# Altium schematic sheet Player.SchDoc
size A2; SheetNumber: 1; SheetTotal: 2
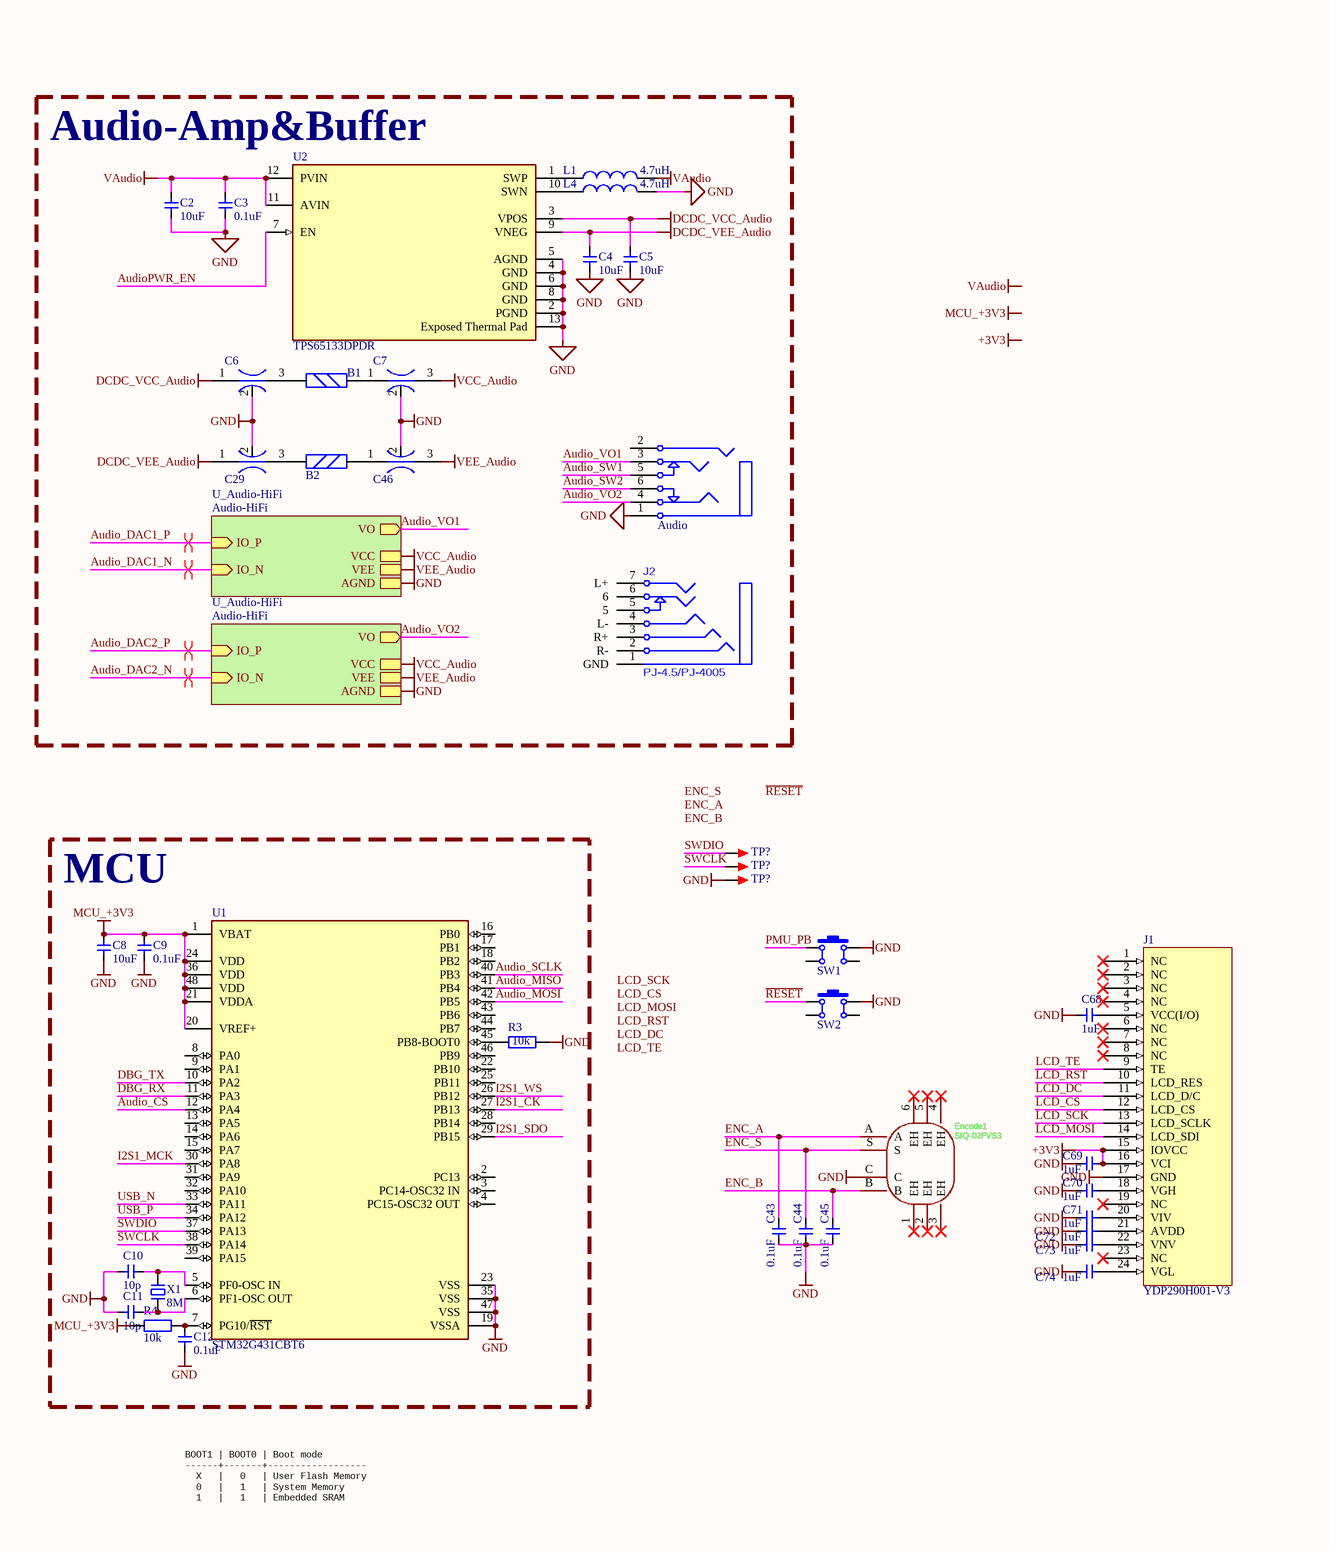
[diagram p0: Player.SchDoc, left]
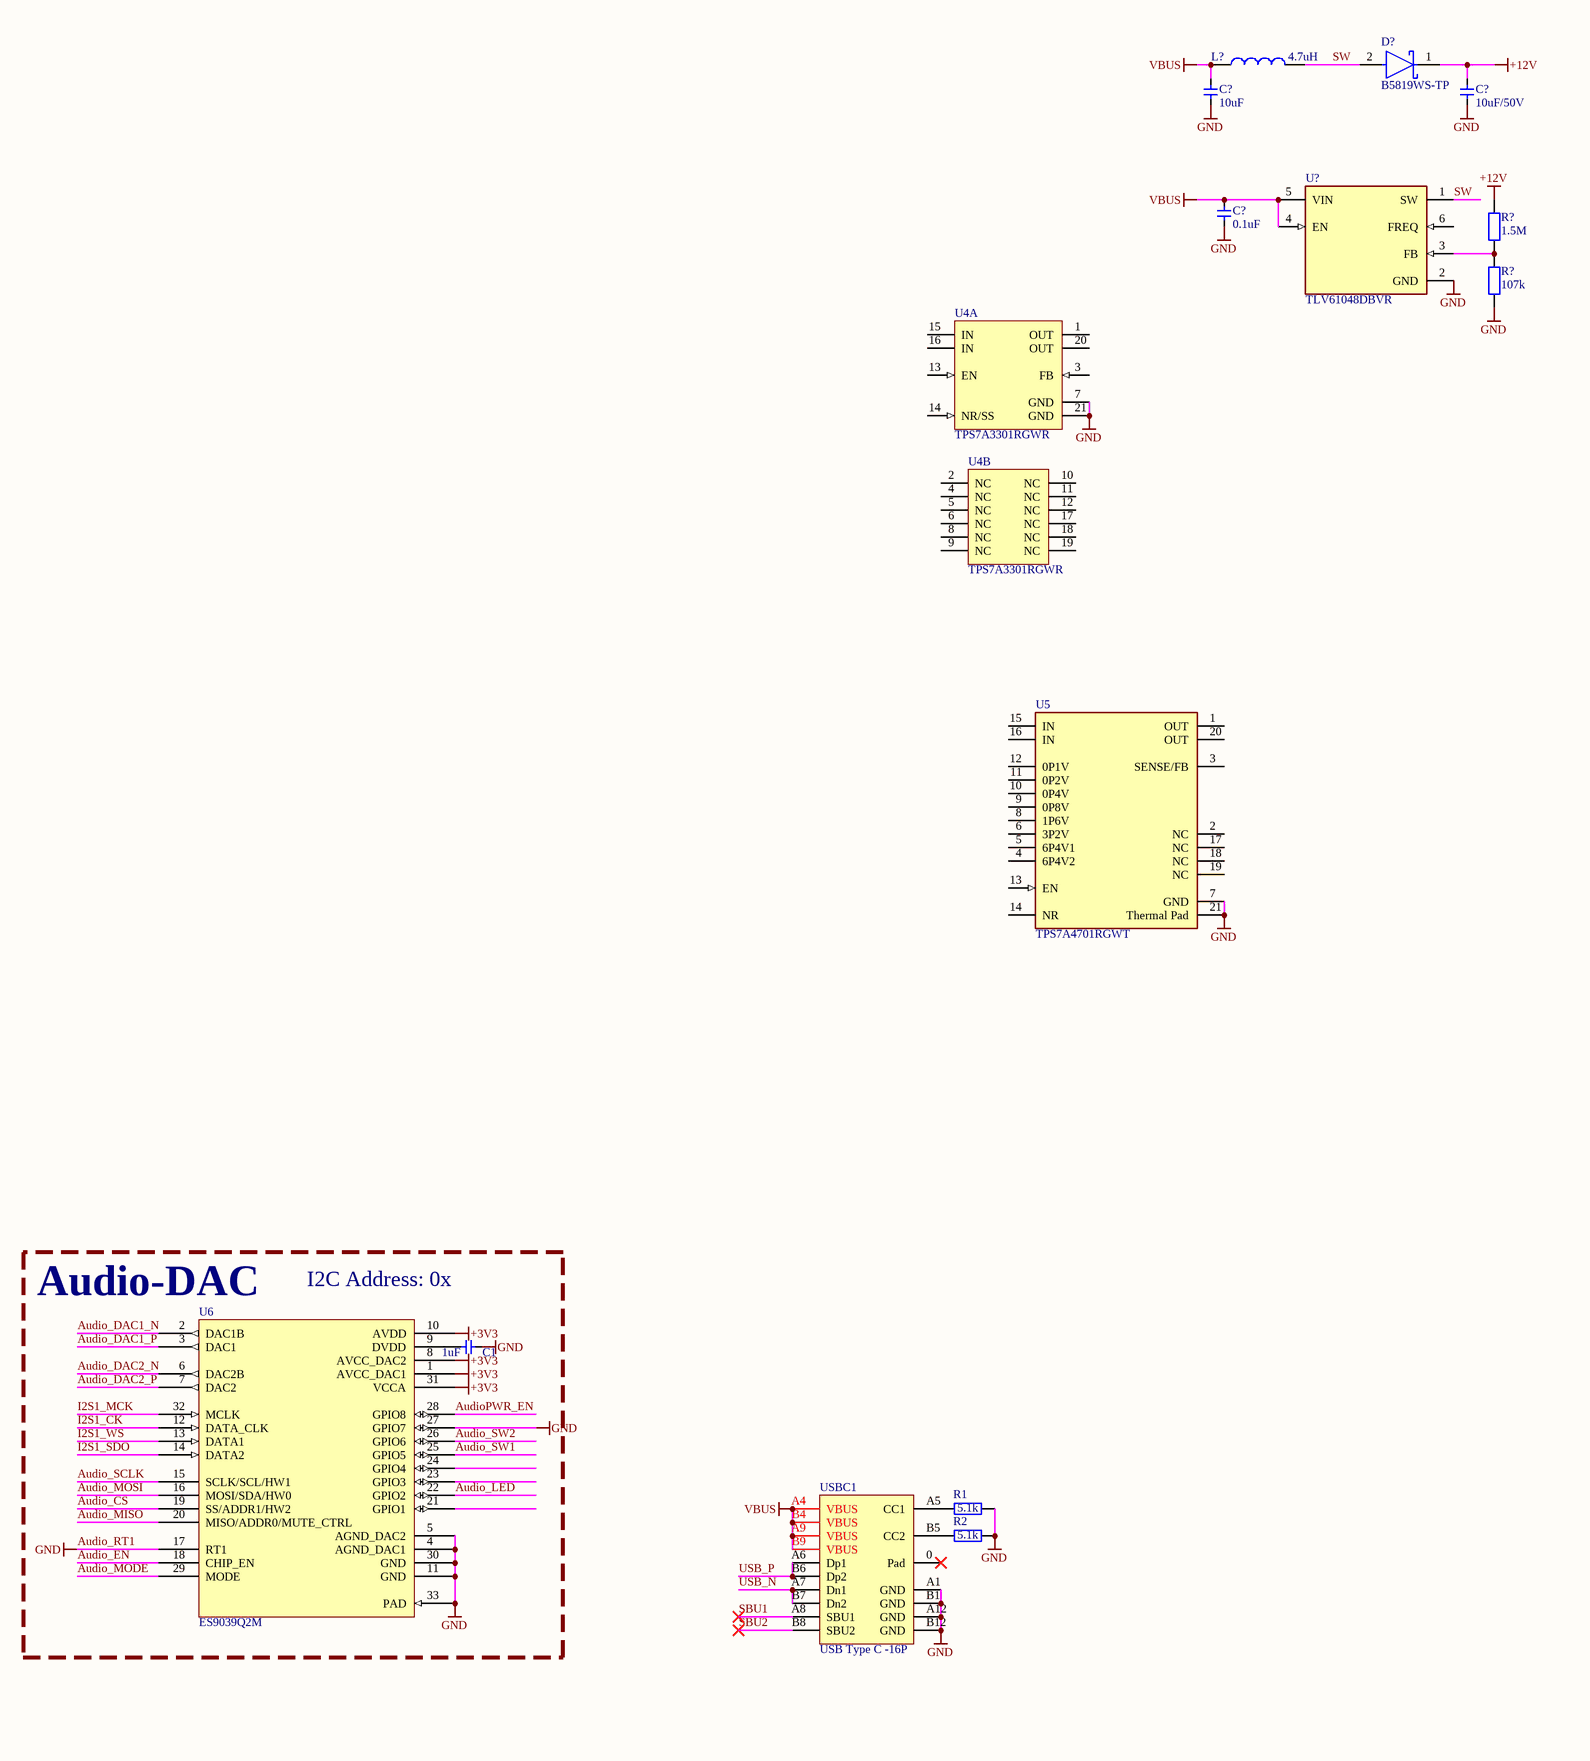
[diagram p1: Player.SchDoc, right]

## Parts
(Parts that share a designator on the sheet are numbered #1, #2 ... from top to bottom, then left to right.)
Audio  PJ342  [PJ342A]  (value not drawn)
B1  BLM15AG601SN1D  [L0603]  (value not drawn)
B2  BLM15AG601SN1D  [L0603]  (value not drawn)
C1  1uF  [0402-C]
C2  10uF  [0402-C]
C3  0.1uF  [0402-C]
C4  10uF  [0402-C]
C5  10uF  [0402-C]
C6  NFM18PS105D0J3D  [FP-NFM18-0_1-e0_05_0_35-MFG]  (value not drawn)
C7  NFM18PS105D0J3D  [FP-NFM18-0_1-e0_05_0_35-MFG]  (value not drawn)
C8  10uF  [0402-C]
C9  0.1uF  [0402-C]
C10  10p  [0402-C]
C11  10p  [0402-C]
C12  0.1uF  [0402-C]
C29  NFM18PS105D0J3D  [FP-NFM18-0_1-e0_05_0_35-MFG]  (value not drawn)
C43  0.1uF  [0402-C]
C44  0.1uF  [0402-C]
C45  0.1uF  [0402-C]
C46  NFM18PS105D0J3D  [FP-NFM18-0_1-e0_05_0_35-MFG]  (value not drawn)
C68  1uF  [0402-C]
C69  1uF  [0402-C]
C70  1uF  [0402-C]
C71  1uF  [0402-C]
C72  1uF  [0402-C]
C73  1uF  [0402-C]
C74  1uF  [0402-C]
C?#1  10uF  [0603-C]
C?#2  10uF/50V  [0603-C]
C?#3  0.1uF  [0402-C]
D?  B5819WS-TP  [FP-SOD-323-IPC_C]
Encode1  SIQ-02FVS3  [SW-SMD_SIQ-02FVS3_1]
J1  YDP290H001-V3  [FPC0.5-WT-24P]
J2  PJ-4.5/PJ-4005  [PJ-4.5]
L1  4.7uH  [L0805]
L4  4.7uH  [L0805]
L?  4.7uH  [L0805]
R1  5.1k  [0603-R]
R2  5.1k  [0603-R]
R3  10k  [0402-R]
R4  10k  [0402-R]
R?#1  1.5M  [0603-R]
R?#2  107k  [0603-R]
SW1  TD-1187SA-250  [SW-SMD-3.5*3.0_4P]  (value not drawn)
SW2  TD-1187SA-250  [SW-SMD-3.5*3.0_4P]  (value not drawn)
TP?#1  (no value)  [TEST 1]
TP?#2  (no value)  [TEST 1]
TP?#3  (no value)  [TEST 1]
U1  STM32G431CBT6  [FP-LQFP48-5B-MFG]
U2  TPS65133DPDR  [FP-DPD0012A-MFG]
U4  TPS7A3301RGWR  [RGW0020A_V]  (parts A,B of 2)
U5  TPS7A4701RGWT  [FP-RGW0020A-MFG]
U6  ES9039Q2M  [QFN32 5x5_L]
U?  TLV61048DBVR  [FP-DBV0006A-IPC_B]
USBC1  USB Type C -16P  [USB-C-SMD_16P]
X1  8M  [XTAL-3215-2P]

## Blocks framed on the sheet
Audio-Amp&Buffer: Audio B1 B2 C2-C7 C29 C46 J2 L1 L4 U2
MCU: C8-C12 R3 R4 U1 X1
Audio-DAC: C1 U6

## Sub-sheets
U_Audio-HiFi = Audio-HiFi: IO_N (in), IO_P (in), VO (out), VCC, VEE, AGND
U_Audio-HiFi = Audio-HiFi: IO_N (in), IO_P (in), VO (out), VCC, VEE, AGND

## Nets
+3V3: C69.2 J1.15(IOVCC) J1.16(VCI) U6.1(AVCC_DAC1) U6.8(AVCC_DAC2) U6.10(AVDD) U6.31(VCCA)
+12V: C?#2.2 D?.1(C) R?#1.2
Audio_RT1: Audio.1 C1.2 C2.1 C3.1 C4.1 C5.1 C6.2(GND) C7.2(GND) C8.1 C9.1 C10.1 C11.1 C12.2 C29.2(GND) C43.2 C44.2 C45.2 C46.2(GND) C68.1 C69.1 C70.1 C71.1 C72.1 C73.1 C74.1 C?#1.1 C?#2.1 C?#3.1 Encode1.C J1.17(GND) L4.2 R1.2 R2.2 R3.1 R?#2.1 SW1.2 SW2.2 TP?#3.1 U1.19(VSSA) U1.23(VSS) U1.35(VSS) U1.47(VSS) U2.2(PGND) U2.4(GND) U2.5(AGND) U2.6(GND) U2.8(GND) U2.13(Exposed_Thermal_Pad) U4.7(GND) U4.21(GND) U5.7(GND) U5.21(Thermal_Pad) U6.4(AGND_DAC1) U6.5(AGND_DAC2) U6.11(GND) U6.17(RT1) U6.27(GPIO7) U6.30(GND) U6.33(PAD) U?.2(GND) USBC1.A1(GND) USBC1.A12(GND) USBC1.B1(GND) USBC1.B12(GND) ; sheet U_Audio-HiFi/AGND, sheet U_Audio-HiFi/AGND  [also labelled GND]
DCDC_VCC_Audio: C5.2 C6.1(Input) U2.3(VPOS)
DCDC_VEE_Audio: C4.2 C29.1(Input) U2.9(VNEG)
MCU_+3V3: C8.2 C9.2 R4.1 U1.1(VBAT) U1.20(VREF+) U1.21(VDDA) U1.24(VDD) U1.36(VDD) U1.48(VDD)
VAudio: C2.2 C3.2 L1.2 U2.11(AVIN) U2.12(PVIN)
VBUS: C?#1.2 C?#3.2 L?.1 U?.4(EN) U?.5(VIN) USBC1.A4(VBUS) USBC1.A9(VBUS) USBC1.B4(VBUS) USBC1.B9(VBUS)
VCC_Audio: C7.3(Output) ; sheet U_Audio-HiFi/VCC, sheet U_Audio-HiFi/VCC
VEE_Audio: C46.3(Output) ; sheet U_Audio-HiFi/VEE, sheet U_Audio-HiFi/VEE
Audio_CS: U1.12(PA4) U6.19(SS/ADDR1/HW2)
Audio_DAC1_N: U6.2(DAC1B) ; sheet U_Audio-HiFi/IO_N
Audio_DAC1_P: U6.3(DAC1) ; sheet U_Audio-HiFi/IO_P
Audio_DAC2_N: U6.6(DAC2B) ; sheet U_Audio-HiFi/IO_N
Audio_DAC2_P: U6.7(DAC2) ; sheet U_Audio-HiFi/IO_P
Audio_EN: U6.18(CHIP_EN)
Audio_LED: U6.22(GPIO2)
Audio_MISO: U1.41(PB4) U6.20(MISO/ADDR0/MUTE_CTRL)
Audio_MODE: U6.29(MODE)
Audio_MOSI: U1.42(PB5) U6.16(MOSI/SDA/HW0)
Audio_SCLK: U1.40(PB3) U6.15(SCLK/SCL/HW1)
Audio_SW1: Audio.5 U6.25(GPIO5)
Audio_SW2: Audio.6 U6.26(GPIO6)
Audio_VO1: Audio.3 ; sheet U_Audio-HiFi/VO
Audio_VO2: Audio.4 ; sheet U_Audio-HiFi/VO
AudioPWR_EN: U2.7(EN) U6.28(GPIO8)
DBG_RX: U1.11(PA3)
DBG_TX: U1.10(PA2)
ENC_A: C43.1 Encode1.A
ENC_B: C45.1 Encode1.B
ENC_S: C44.1 Encode1.S
I2S1_CK: U1.27(PB13) U6.12(DATA_CLK)
I2S1_MCK: U1.30(PA8) U6.32(MCLK)
I2S1_SDO: U1.29(PB15) U6.14(DATA2)
I2S1_WS: U1.26(PB12) U6.13(DATA1)
LCD_CS: J1.12(LCD_CS)
LCD_DC: J1.11(LCD_D/C)
LCD_MOSI: J1.14(LCD_SDI)
LCD_RST: J1.10(LCD_RES)
LCD_SCK: J1.13(LCD_SCLK)
LCD_TE: J1.9(TE)
PMU_PB: SW1.1
~{RESET}: SW2.1
SBU1: USBC1.A8(SBU1)
SBU2: USBC1.B8(SBU2)
SW: D?.2(A) L?.2 U?.1(SW)
SWCLK: TP?#2.1 U1.38(PA14)
SWDIO: TP?#1.1 U1.37(PA13)
USB_N: U1.33(PA11) USBC1.A7(Dn1) USBC1.B7(Dn2)
USB_P: U1.34(PA12) USBC1.A6(Dp1) USBC1.B6(Dp2)
NetB1_1: B1.1 C7.1(Input)
NetB1_2: B1.2 C6.3(Output)
NetB2_1: B2.1 C46.1(Input)
NetB2_2: B2.2 C29.3(Output)
NetC1_1: C1.1 U6.9(DVDD)
NetC10_2: C10.2 U1.5(PF0-OSC_IN) X1.2
NetC11_2: C11.2 U1.6(PF1-OSC_OUT) X1.1
NetC12_1: C12.1 R4.2 U1.7(PG10/~{RST})
NetC68_2: C68.2 J1.5(VCC(I/O))
NetC70_2: C70.2 J1.18(VGH)
NetC71_2: C71.2 J1.20(VIV)
NetC72_2: C72.2 J1.21(AVDD)
NetC73_2: C73.2 J1.22(VNV)
NetC74_2: C74.2 J1.24(VGL)
NetL1_1: L1.1 U2.1(SWP)
NetL4_1: L4.1 U2.10(SWN)
NetR1_1: R1.1 USBC1.A5(CC1)
NetR2_1: R2.1 USBC1.B5(CC2)
NetR3_2: R3.2 U1.45(PB8-BOOT0)
NetR?#1_1: R?#1.1 R?#2.2 U?.3(FB)

Not connected (* = marked no-connect by the designer): Audio 2; Encode1 1(EH)* 2(EH)* 3(EH)* 4(EH)* 5(EH)* 6(EH)*; J1 1(NC)* 2(NC)* 3(NC)* 4(NC)* 6(NC)* 7(NC)* 8(NC)* 19(NC)* 23(NC)*; J2 1(GND) 2(R-) 3(R+) 4(L-) 5 6 7(L+); SW1 3 4; SW2 3 4; U1 2(PC13) 3(PC14-OSC32_IN) 4(PC15-OSC32_OUT) 8(PA0) 9(PA1) 13(PA5) 14(PA6) 15(PA7) 16(PB0) 17(PB1) 18(PB2) 22(PB10) 25(PB11) 28(PB14) 31(PA9) 32(PA10) 39(PA15) 43(PB6) 44(PB7) 46(PB9); U4 1(OUT) 2(NC) 3(FB) 4(NC) 5(NC) 6(NC) 8(NC) 9(NC) 10(NC) 11(NC) 12(NC) 13(EN) 14(NR/SS) 15(IN) 16(IN) 17(NC) 18(NC) 19(NC) 20(OUT); U5 1(OUT) 2(NC) 3(SENSE/FB) 4(6P4V2) 5(6P4V1) 6(3P2V) 8(1P6V) 9(0P8V) 10(0P4V) 11(0P2V) 12(0P1V) 13(EN) 14(NR) 15(IN) 16(IN) 17(NC) 18(NC) 19(NC) 20(OUT); U6 21(GPIO1) 23(GPIO3) 24(GPIO4); U? 6(FREQ); USBC1 0(Pad)*

## Layout directives
differential pair: Audio_DAC1_N, Audio_DAC1_P, Audio_DAC2_N, Audio_DAC2_P

## Notes on the sheet
- I2C Address: 0x
- BOOT1 | BOOT0 | Boot mode
  ------+-------+------------------
  X   |   0   | User Flash Memory
  0   |   1   | System Memory
  1   |   1   | Embedded SRAM
- Labels drawn without touching a wire or pin: +3V3, ENC_A, ENC_B, ENC_S, LCD_CS, LCD_DC, LCD_MOSI, LCD_RST, LCD_SCK, LCD_TE, MCU_+3V3, VAudio, ~{RESET}

## Library data of the parts
Audio = PJ342: 3.5耳机插座,4Pin; BOM名称: 耳机插座; 当前库版本V2023.8.14 @淘宝卖家:黄晶宝石: 最新版本发布https://item.taobao.com/item.htm?id=566775463719
B1 B2 = BEAD
C1-C5 C8-C12 C43-C45 C68-C74 C?#1-C?#3 = 电容-0402: Capacitor; Value: 0.1u
C6 C7 C29 C46 = CMP-06053-000028-1: CAP FEEDTHRU 1UF 20% 6.3V 0603; DC Resistance (DCR): 30mR; Current: 2A; Length: 0.063inch; Package Quantity: 4000; Capacitance: 1uF; Height: 0.028inch; Mount: Surface Mount; Max Operating Temperature: 125°C; Voltage Rating: 6.3V; Case/Package: 0603; Tolerance: 20%; Case Code (Metric): 1608; Min Operating Temperature: -55°C; Packaging: Tape and Reel; Case Code (Imperial): 0603; Voltage Rating (DC): 6.3V; Width: 0.031inch
D? = CMP-56206-000009-1: DIODE SCHOTTKY 40V 1A SOD323; Max Reverse Leakage Current: 1mA; Peak Non-Repetitive Surge Current: 10A; Forward Voltage: 900mV; Element Configuration: Single; Max Reverse Voltage (DC): 40V; Number of Pins: 2; Max Operating Temperature: 125°C; Package Quantity: 1; Radiation Hardening: No; Average Rectified Current: 1A; Lead Free: Lead Free; Series: -; Mount: Surface Mount; Min Operating Temperature: -65°C; RoHS Compliant: Yes; Packaging: Tape and Reel; Max Surge Current: 10A
Encode1 = SIQ-02FVS3: Manufacturer: MITSUMI(美上美); Add into BOM: yes; Symbol: SIQ-02FVS3; Device: SIQ-02FVS3; LCSC Part Name: 拨轮滚轮旋转编码器开关; Supplier Part: C2925423; Manufacturer Part: SIQ-02FVS3; Supplier Footprint: SMD; JLCPCB Part Class: Extended Part; Datasheet: https://atta.szlcsc.com/upload/public/pdf/source/20220728/2FBC1A98A06DC86460FC69DAE20456FC.pdf; Supplier: LCSC; Convert to PCB: yes
J1 = YDP290H001-V3: 鱼鹰光电
L1 L4 L? = L: 贴片小功率电感; BOM名称: 小功率贴片电感; 联系下单店铺卖家 免费帮你查找封装: 联系下单店铺卖家 免费技术支持
R1-R4 R?#1 R?#2 = R: 贴片电阻; 联系卖家，免费查找封装: 唯一出售店铺网址https://shop463601444.taobao.com; BOM名称: 贴片电阻
SW1 SW2 = TD-1187SA-250: 小乌龟-侧按4脚开关 带定位柱; 联系下单店铺卖家 免费技术支持: 联系下单店铺卖家 免费帮你查找封装
TP?#1-TP?#3 = TEST: 测试点; 联系下单店铺卖家 免费技术支持: 联系下单店铺卖家 免费帮你查找封装; BOM名称: 测试点
U1 = CMP-12105-000030-1: MAINSTREAM ARM CORTEX-M4+ MCU 17; Manufacturer: STMicroelectronics; Number Of Adc Channels: 17; Number Of I/Os: 38; Standoff Height: 0.05mm; Number Of Usb Channels: 1; Data Bus Width: 32bits; Number Of I2C Channels: 3; Number Of Pwm Channels: 31; Frequency: 170MHz; Memory Type: FLASH; Number Of Timers/Counters: 14; Ram Size: 32KBytes; Max Junction Temp: +105°C; Memory Size: 128KBytes; Min Supply Voltage: 1.62V; Max Supply Voltage: 3.6V; Number Of Uart Channels: 4; Interface: I2C,SPI,UART,USART,CAN,USB,LIN,IrDA,I2S; Temperature Range Low: -40°C; Lead Free: Yes; Device Class L3: Microcontrollers; Number Of Cores: 1; Temperature Range High: +85°C; Height: 1.6mm; Digikey Description: MAINSTREAM ARM CORTEX-M4+ MCU 17; Device Class L1: Integrated Circuits (ICs); Package: LQFP48-5B; RoHS: TRUE; Number Of A/D Converters: 1; Core Architecture: Arm Cortex-M4; Device Class L2: Embedded Processors and Controllers; ComponentLink2Description: Datasheet; Temperature: -40°C to +85°C; Ambient Temperature Range High: +85°C; Ambient Temperature Range Low: -40°C; Octopart: https://octopart.com/stm32g431cbt6-stmicroelectronics-98835224; ComponentLink2URL: https://www.st.com/resource/en/datasheet/stm32g431cb.pdf; Automotive: No; Number Of Spi Channels: 3; Manufacturer Part Number: STM32G431CBT6; Category: IC
U2 = CMP-04918-000430-1: IC REG AMOLED DISPL 2OUT 12WSON; Number of Channels: 2; Max Supply Voltage: 5V; Min Supply Voltage: 2.9V; Output Voltage: -5V; Mount: Surface Mount; Case/Package: QFN; Packaging: Tape and Reel; Lead Free: Lead Free; Radiation Hardening: No; Min Operating Temperature: -40°C; Number of Outputs: 2; Max Operating Temperature: 85°C; Number of Pins: 12; RoHS Compliant: Yes; Package Quantity: 3000
U4 = CMP-0395-01391-2: Single Output High PSRR LDO, 1 A, Adjustable -1.18 to -33 V Output, -3 to -36 V Input, with Ultra-Low Noise, 20-pin VQFN (RGW), -40 to 125 degC, Green (RoHS & no Sb/Br); Manufacturer: Texas Instruments; SubFamily: Single Channel LDO; Vdo(Typ)(mV): 290; Iq(Typ)(mA): 0.21; Iout(Max)(A): 1; Accuracy(%): 1.5; PackageDescription: 20-Pin Plastic Quad Flat No-Pin, 5 x 5 mm Body, 0.65 mm Pitch, 3.15 x 3.15 mm Exposed Pad; DatasheetVersion: SBVS169B; ComponentLink1Description: Manufacturer URL; ComponentLink2Description: Datasheet; PartNumber: TPS7A3301RGWR; Eco-Plan: Green (RoHS & no Sb/Br); Vin(Min)(V): -3; ComponentLink2URL: http://www.ti.com/general/docs/lit/getliterature.tsp?genericPartNumber=TPS7A3301&fileType=pdf; ComponentLink3Description: Package Specification; PackageReference: RGW0020A; Vout Adj(Max)(V): -33; Vin(Max)(V): -36; Vout Adj(Min)(V): -1.18; ComponentLink1URL: http://www.ti.com/; Code_JEDEC: MO-220; ComponentLink3URL: http://www.ti.com/litv/pdf/mpqf122b; Mounting Technology: Surface Mount
U5 = CMP-04917-000017-1: IC REG LINEAR POS ADJ 1A 20VQFN; Manufacturer: Texas Instruments; Output Type: AdjustableProgrammable; Dropout Voltage: 307mV; Number Of Outputs: 1; Nominal Supply Current: 0.58-6.1mA; Max Supply Voltage: 35V; Max Junction Temp: +125°C; Standoff Height: 0mm; Accuracy Percentage: 2.5%; Output Voltage: 1.4-34mV; Min Supply Voltage: 3V; Automotive: No; Output Current: 1A; ComponentLink2Description: Datasheet; Octopart: https://octopart.com/tps7a4701rgwt-texas+instruments-30261754; Height: 1mm; Category: IC; Temperature: -40°C to +125°C; Temperature Range High: +125°C; Device Class L1: Integrated Circuits (ICs); Temperature Range Low: -40°C; Device Class L3: Voltage Regulators - Linear; Manufacturer Part Number: TPS7A4701RGWT; Digikey Description: IC REG LINEAR POS ADJ 1A 20VQFN; Device Class L2: Power Management ICs; Lead Free: Yes; Package: RGW0020A; Mouser Description: LDO Voltage Regulators 36V 1A 4.17uVRMS RF LDO VTG Reg; ComponentLink2URL: http://www.ti.com/lit/ds/symlink/tps7a47.pdf; RoHS: TRUE
U? = CMP-04918-000262-1: IC REG BOOST ADJ SOT23-6
USBC1 = USB-Tyoe-C 16P-2.0: type-C-16pin
X1 = XTAL-2P: 2脚无源晶振(谐振器）; 联系下单店铺卖家 免费帮你查找封装: 联系下单店铺卖家 免费技术支持; BOM名称: 2脚无源晶振(谐振器）